# Altium schematic sheet stm32f103c8.SchDoc
size A4
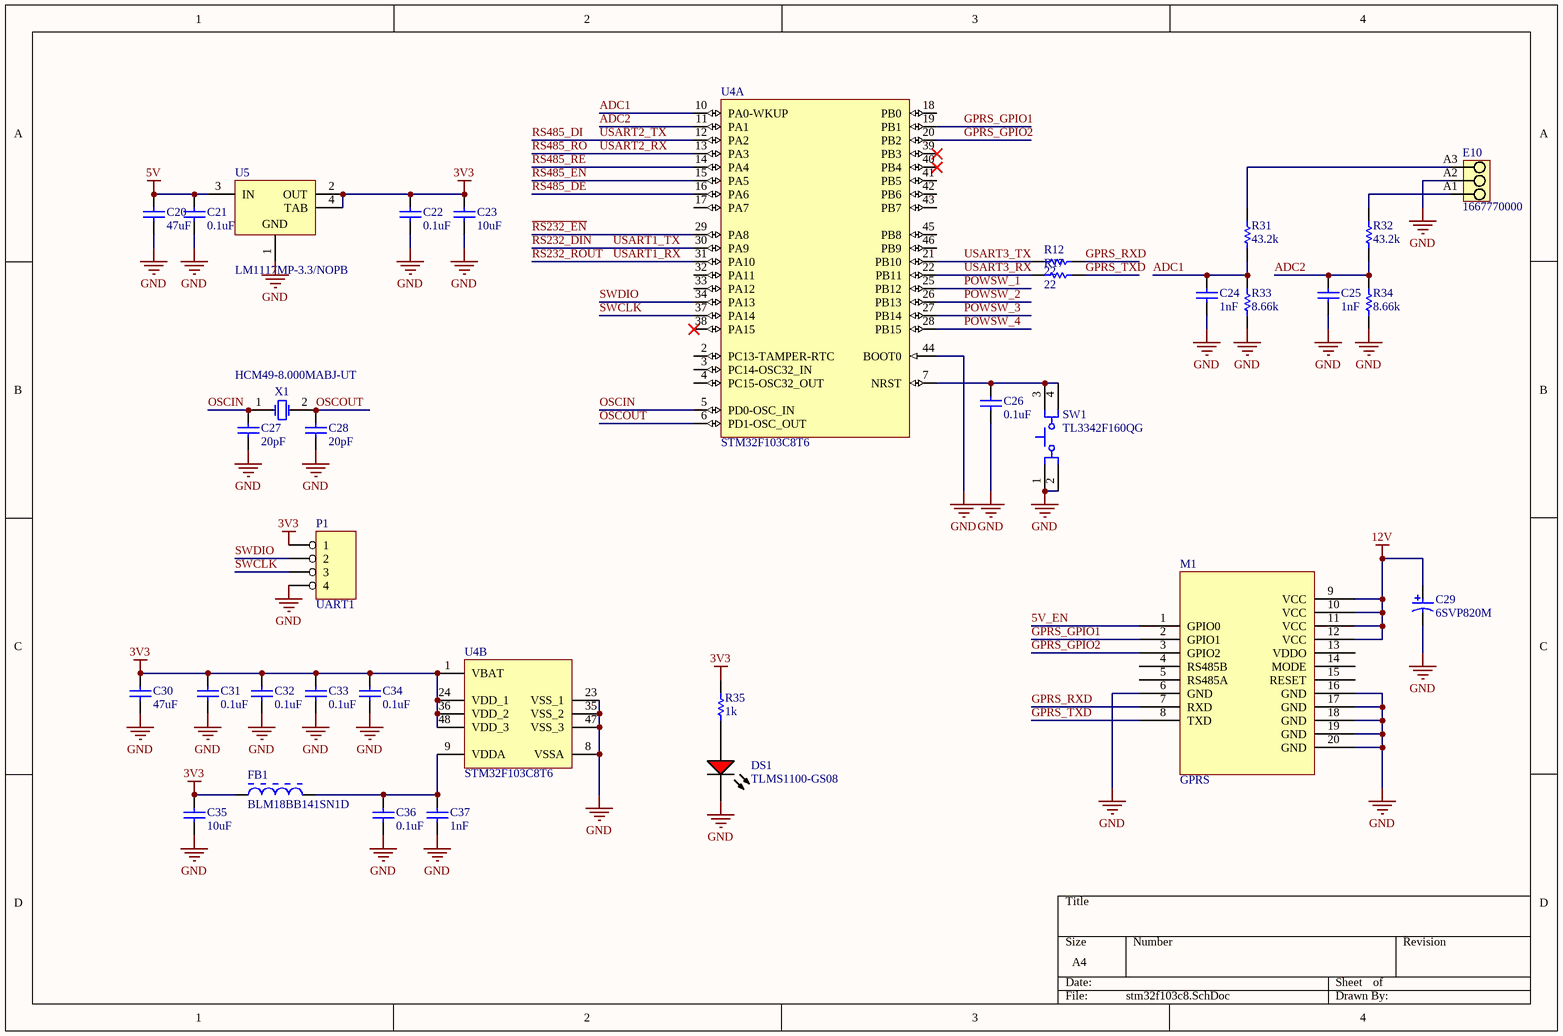
[diagram p0: stm32f103c8.SchDoc]

## Parts
C20  47uF  [CAPC1206(3216)150_L]
C21  0.1uF  [CAPC0603(1608)100_L]
C22  0.1uF  [CAPC0603(1608)100_L]
C23  10uF  [CAPC0805(2012)145_L]
C24  1nF  [CAPC0603(1608)100_L]
C25  1nF  [CAPC0603(1608)100_L]
C26  0.1uF  [CAPC0603(1608)100_L]
C27  20pF  [CAPC0603(1608)100_L]
C28  20pF  [CAPC0603(1608)100_L]
C29  6SVP820M  [PNSC-SVP-F12_L]
C30  47uF  [CAPC1206(3216)150_L]
C31  0.1uF  [CAPC0603(1608)100_L]
C32  0.1uF  [CAPC0603(1608)100_L]
C33  0.1uF  [CAPC0603(1608)100_L]
C34  0.1uF  [CAPC0603(1608)100_L]
C35  10uF  [CAPC0603(1608)100_L]
C36  0.1uF  [CAPC0603(1608)100_L]
C37  1nF  [CAPC0603(1608)100_L]
DS1  TLMS1100-GS08  [VISH-TLMX1100_V]
E10  1667770000  [LM_3_5_90_03]
FB1  BLM18BB141SN1D  [MURA-BLM18-RF-H4-CHIP-2_V]
M1  GPRS  [GPRS]
P1  UART1  [header4]
R12  22  [RESC0603(1608)_L]
R17  22  [RESC0603(1608)_L]
R31  43.2k  [RESC0603(1608)_L]
R32  43.2k  [RESC0603(1608)_L]
R33  8.66k  [RESC0603(1608)_L]
R34  8.66k  [RESC0603(1608)_L]
R35  1k  [RESC0603(1608)_L]
SW1  TL3342F160QG  [ESWI-TL3342F160QG_V]
U4  STM32F103C8T6  [STM-LQFP48_L]  (parts A,B of 2)
U5  LM1117MP-3.3/NOPB  [DCY0004A_L]
X1  HCM49-8.000MABJ-UT  [CFM-HCM49-2_V]

## Nets
3V3: C22.2 C23.2 C30.2 C31.2 C32.2 C33.2 C34.2 C35.2 FB1.1 P1.1 R35.2 U4.1(VBAT) U4.24(VDD_1) U4.36(VDD_2) U4.48(VDD_3) U5.2(OUT) U5.4(TAB)
5V: C20.2 C21.2 U5.3(IN)
12V: C29.1 M1.9(VCC) M1.10(VCC) M1.11(VCC) M1.12(VCC)
GND: C20.1 C21.1 C22.1 C23.1 C24.1 C25.1 C26.1 C27.1 C28.1 C29.2 C30.1 C31.1 C32.1 C33.1 C34.1 C35.1 C36.1 C37.1 DS1.2(K) E10.A2 M1.6(GND) M1.16(GND) M1.17(GND) M1.18(GND) M1.19(GND) M1.20(GND) P1.4 R33.1 R34.1 SW1.1 SW1.2 U4.8(VSSA) U4.23(VSS_1) U4.35(VSS_2) U4.44(BOOT0) U4.47(VSS_3) U5.1(GND)
5V_EN: M1.1(GPIO0)
ADC1: C24.2 R31.1 R33.2 U4.10(PA0-WKUP)
ADC2: C25.2 R32.1 R34.2 U4.11(PA1)
GPRS_GPIO1: M1.2(GPIO1) U4.19(PB1)
GPRS_GPIO2: M1.3(GPIO2) U4.20(PB2)
GPRS_RXD: M1.7(RXD) R12.1
GPRS_TXD: M1.8(TXD) R17.1
OSCIN: C27.2 U4.5(PD0-OSC_IN) X1.1(X1)
OSCOUT: C28.2 U4.6(PD1-OSC_OUT) X1.2(X2)
POWSW_1: U4.25(PB12)
POWSW_2: U4.26(PB13)
POWSW_3: U4.27(PB14)
POWSW_4: U4.28(PB15)
~{RS232_EN}: U4.29(PA8)
~{RS485_EN}: U4.15(PA5)
RS232_DIN: U4.30(PA9)  [also labelled USART1_TX]
RS232_ROUT: U4.31(PA10)  [also labelled USART1_RX]
RS485_DE: U4.16(PA6)
RS485_DI: U4.12(PA2)  [also labelled USART2_TX]
RS485_~{RE}: U4.14(PA4)
RS485_RO: U4.13(PA3)  [also labelled USART2_RX]
SWCLK: P1.3 U4.37(PA14)
SWDIO: P1.2 U4.34(PA13)
USART3_RX: R17.2 U4.22(PB11)
USART3_TX: R12.2 U4.21(PB10)
NetC26_2: C26.2 SW1.3 SW1.4 U4.7(NRST)
NetC36_2: C36.2 C37.2 FB1.2 U4.9(VDDA)
NetDS1_1: DS1.1(A) R35.1
NetE10_A1: E10.A1 R32.2
NetE10_A3: E10.A3 R31.2

Not connected (* = marked no-connect by the designer): M1 4(RS485B) 5(RS485A) 13(VDDO) 14(MODE) 15(RESET); U4 2(PC13-TAMPER-RTC) 3(PC14-OSC32_IN) 4(PC15-OSC32_OUT) 17(PA7) 18(PB0) 32(PA11) 33(PA12) 38(PA15)* 39(PB3)* 40(PB4)* 41(PB5) 42(PB6) 43(PB7) 45(PB8) 46(PB9)

## Library data of the parts
C20 C30 = CAP_5_3: 1206 (3216 Metric) Chip Capacitor; Case-Metric: 3216; Case-EIA: 1206; PackageReference: CAPC1206(3216)150
C21 C22 C24-C28 C31-C37 = CAP_5: 0603 (1608 Metric) Chip Capacitor; Case-Metric: 1608; Case-EIA: 0603; PackageReference: CAPC0603(1608)100
C23 = CAP_5_1: 0805 (2012 Metric) Chip Capacitor; Case-EIA: 0805; Case-Metric: 2012; PackageReference: CAPC0805(2012)145
C29 = CMP-2000-05494-1: Conductive Polymer Aluminum Solid Capacitor, 820 uF, +/- 20%, 6.3 V, -55 to 105 degC, 2-Pin SMD (F12), RoHS, Tape and Reel; Manufacturer: Panasonic; Featured Product: OS-CONCapacitorsHotNewTechnologies; Surface Mount Land Size: 0.406"Lx0.406"W(10.30mmx10.30mm); Online Catalog: OS-CON,SVPSeries; Other Names: P16463TR; ESR (Equivalent Series Resistance): 16mOhm; Lifetime @ Temp.: 2000Hrs@105°C; Polarization: Polar; Voltage Rating: 16V; Ripple Current: 4.72A; EDA / CAD Models: DownloadfromAcceleratedDesigns; Capacitance: 330µF; Operating Temperature: -55°C~105°C; Family: Aluminum-PolymerCapacitors; Packaging: Tape&Reel(TR); Series: OS-CON,SVP; Package Reference: SVP-F12; Package / Case: Radial,Can-SMD; Size / Dimension: 0.394"Dia(10.00mm); Mounting Type: SurfaceMount; Package Description: 2-Pin Surface Mount Device, Body 10.3 x 10.3 mm; Category: Capacitors; Datasheet URL: https://industrial.panasonic.com/cdbs/www-data/pdf/AAB8000/AAB8000C193.pdf; Tolerance: ±20%; Manufacturer URL: http://www.panasonic.com/; Height - Seated (Max): 0.500"(12.70mm); Mounting Technology: SurfaceMount; Datasheet Version: 11/2015; Standard Package: 400
DS1 = CMP-1666-00027-1: LED, RED, 2.1 V, -40 to 100 degC, 2-Pin SMD (0603), RoHS, Tape and Reel; Type (Capacitors): C0G; Resistance: 100000000000 Ohm; Capacitance: 12 pF; Voltage Rating: 50 V; Tolerance: 5%; Min Operating Temperature: -55degC; REACH SVHC: No SVHC; ComponentLink2Description: Datasheet; ComponentLink1URL: http://www.vishay.com/; Width: 0.8 mm; Package Quantity: 4000; PackageReference: TLMX1100; ComponentLink2URL: http://www.vishay.com/docs/83173/tlmb1100.pdf; Case/Package: 0603; Case Code (Metric): 1608; Packaging: Tape and Reel; Pins: 2; ComponentLink1Description: Manufacturer URL; Max Operating Temperature: 125degC; Height: 0.8 mm; Length: 1.6 mm; Mount: Surface Mount; PackageDescription: 2-Pin Surface Mount Device, Body 1.6 x 0.8 mm; DatasheetVersion: Rev. 2.7, 03/2016; Case Code (Imperial): 0603; Voltage Rating (DC): 50 V; RoHSCompliant: True; Radiation Hardening: No
E10 = CMP-1559-01729-1: OMNIMATE Signal - series LM; Manufacturer: Weidmueller; Contact_material: Cu-Leg; Contact_surface: tinned; Rated_current_use_group_B_UL_1059: 10 A; Insulating_material: PA; Wire_cross_section_AWG_min_UL_1059: AWG 28; Short_text_for_material: LM 3.50/03/90 3.2SN OR BX; Solid_max_H05_07_V_U: 1,5 mm²; Rated_current_min_no_of_poles_TU_20_deg_C: 32 A; Solder_pin_length_mm: 3,2 mm; Mounting_onto_the_PCB: Solder connection; Wire_cross_section_AWG_max_UL_1059: AWG 14; No_of_poles: 3; Rated_voltage_use_group_B_UL_1059: 300 V; Side_termination_characteristic: closed side; Rated_voltage_for_surge_voltage_class_pollution_degree_II_2: 320 V; UL_94_flammability_rating: V-2; Pitch_mm: 3,5 mm; Pitch_inch: 0,138 inch; Solid_min_H05_07_V_U: 0,5 mm²; ComponentLink2URL: http://catalog.weidmueller.com/catalog/Start.do?localeId=en&ObjectID=1667770000; Revision: V1; ComponentLink2Description: URL Link1; Packaging: Box; Colour: Orange; ComponentLink1Description: Manufacturer URL; PackageReference: LM_3_5_90_03; Qty: 100 PCS; PartNumber: 1667770000; ComponentLink1URL: http://www.weidmueller.com/
FB1 = MURA-FB-2: Chip Ferrite Bead for High-speed Signal Lines, 140 Ohm, 450 mA, -55 to 125 degC, 1.6 x 0.8 x 0.95 mm SMD, Tape and Reel; Manufacturer: Murata; Rated Current: 450 mA; DC Resistance: 0.35 Ohm Max.; Impedance (at 100 MHz): 140 Ohm +/- 25%; ComponentLink2URL: http://www.murata.com/products/catalog/pdf/c31e.pdf; ComponentLink1Description: Manufacturer URL; ComponentLink1URL: http://www.murata.com/; Packing: Tape and Reel; ComponentLink3URL: http://www.murata.com/products/catalog/pdf/c31e.pdf; PartNumber: BLM18BB141SN1D; Operating Temperature Range: -55 to 125 degC; PackageReference: BLM18_H950-2; DatasheetVersion: 08/2013; ComponentLink3Description: Package Specification; ComponentLink2Description: Datasheet; PackageDescription: 2-Pin Chip, Body 1.6 x 0.8 mm; Mounting Technology: Surface Mount
M1 = GPRS_M
P1 = HEADER 4
R12 R17 R31-R35 = RES_3_1: 0603 (1608 Metric) Chip Resistor; Case-Metric: 1608; Case-EIA: 0603; PackageReference: RESC0603(1608)
SW1 = CMP-1696-00003-1: Switch, Tactile, SPST-NO, 50 mA, 12 V, 4-Pin SMD, RoHS, Tape and Reel; Voltage Rating (DC): 50 V; Tolerance: 20%; Case\Package: Radial; Capacitance: 4.7 uF; Max Operating Temperature: 85 degC; REACH SVHC: No SVHC; Package Quantity: 200; Voltage Rating: 50 V; ComponentLink1Description: Manufacturer URL; ComponentLink2URL: http://spec_sheets.e-switch.com/specs/P010632.pdf; ComponentLink2Description: Datasheet; Height: 11 mm; Lead Pitch: 2 mm; RoHSCompliant: true; Radiation Hardening: No; Pins: 2; Length: 11 mm; DatasheetVersion: Rev. I, 12/2010; PackageReference: TL3342F160QG; ComponentLink1URL: http://www.e-switch.ch/en/; PackageDescription: 4-Pin Surface Mount Device, Body 5 x 5 mm, Pitch 6.3 mm; Mount: Through Hole; Diameter: 5 mm; Packaging: Bulk; Min Operating Temperature: -40 degC; Width: 0 inch
U4 = CMP-0237-00215-3: ARM Cortex-M3 32-bit MCU, 64 KB Flash, 20 KB Internal RAM, 37 I/Os, 48-pin LQFP, -40 to 85 degC, Tray; Supply Voltage(Vcc) min (V): 2; Internal RAM Size (kB): 20; FLASH Size (Prog) (kB): 64; A/D Converter: 2x12-bit (10 Channel); I/Os (High Current): 37; Operating Frequency(F) (Processor speed) (MHz): 72; Core: ARM Cortex-M3; ComponentLink3Description: Package Specification; Mounting Technology: Surface Mount; PartNumber: STM32F103C8T6; PackageReference: LQFP48; Packing: Tray; ComponentLink3URL: http://www.st.com/st-web-ui/static/active/en/resource/technical/document/datasheet/DM00058181.pdf; DatasheetVersion: Rev. 16; ComponentLink1URL: http://www.st.com/web/en/home.html; PackageVersion: Rev. 6, 06/2013; ComponentLink2URL: http://www.st.com/st-web-ui/static/active/en/resource/technical/document/datasheet/CD00161566.pdf; ComponentLink1Description: Manufacturer URL; ComponentLink2Description: Datasheet; PackageDescription: 48-Pin Low Profile Quad Flat Package, 7 x 7 mm Body, 0.5 mm Pitch
U5 = CMP-0062-01638-4: 800mA Low-Dropout Linear Regulator, 4-pin SOT-223, Pb-Free; Manufacturer: Texas Instruments; CompType: LDO IC; PackageTopMarking: XYTT*N05A; High-Reliability: Y; PowerWise: N; ComponentLink1URL: http://www.ti.com/general/docs/lit/getliterature.tsp?genericPartNumber=LM1117-N&fileType=pdf; PinCount: 4; PackageDescription: Molded SOT-223, 6.50 x 3.56 x 1.6mm Body, 4 Lead, 2.3mm Pitch; Code_IPC: SOT223-4; PartNumber: LM1117MP-3.3/NOPB; Code_JEDEC: TO-261-AA; RoHS: Y; PackageReference: DCY0004A; ComponentLink1Description: Datasheet URL
X1 = CMP-1215-00001-1: At-Cut Crystal Unit, 3.5 to 30 MHz, -40 to 85 degC, 2-Pin 11.4Ã—4.7Ã—4.3 mm SMD, RoHS, Reel; Manufacturer: Citizen Finetech Miyota; DL: 100 uW; C0: 7 pF Max.; R1: 50 to 200 Ohm; IR: 500 MOhm Min.; f0: 3.5 to 30 MHz; Mounting Technology: Surface Mount; Packing: Reel; ComponentLink2URL: http://cfm.citizen.co.jp/english/product/pdf/HCM49.pdf; PartNumber: HCM49-8.000MABJ-UT; Operating Temperature: -40 to 85 degC; ComponentLink3URL: http://cfm.citizen.co.jp/english/product/pdf/HCM49.pdf; ComponentLink2Description: Datasheet; ComponentLink3Description: Package Specification; ComponentLink1Description: Manufacturer URL; PackageDescription: 2-Pin Surface Mount, Body 11.4 x 4.7 mm, Pitch 8.5 mm; DatasheetVersion: Jan-12; RoHS: TRUE; ComponentLink1URL: http://cfm.citizen.co.jp/english/index.html